# Altium project Asterisk TSOP board.PrjPCB
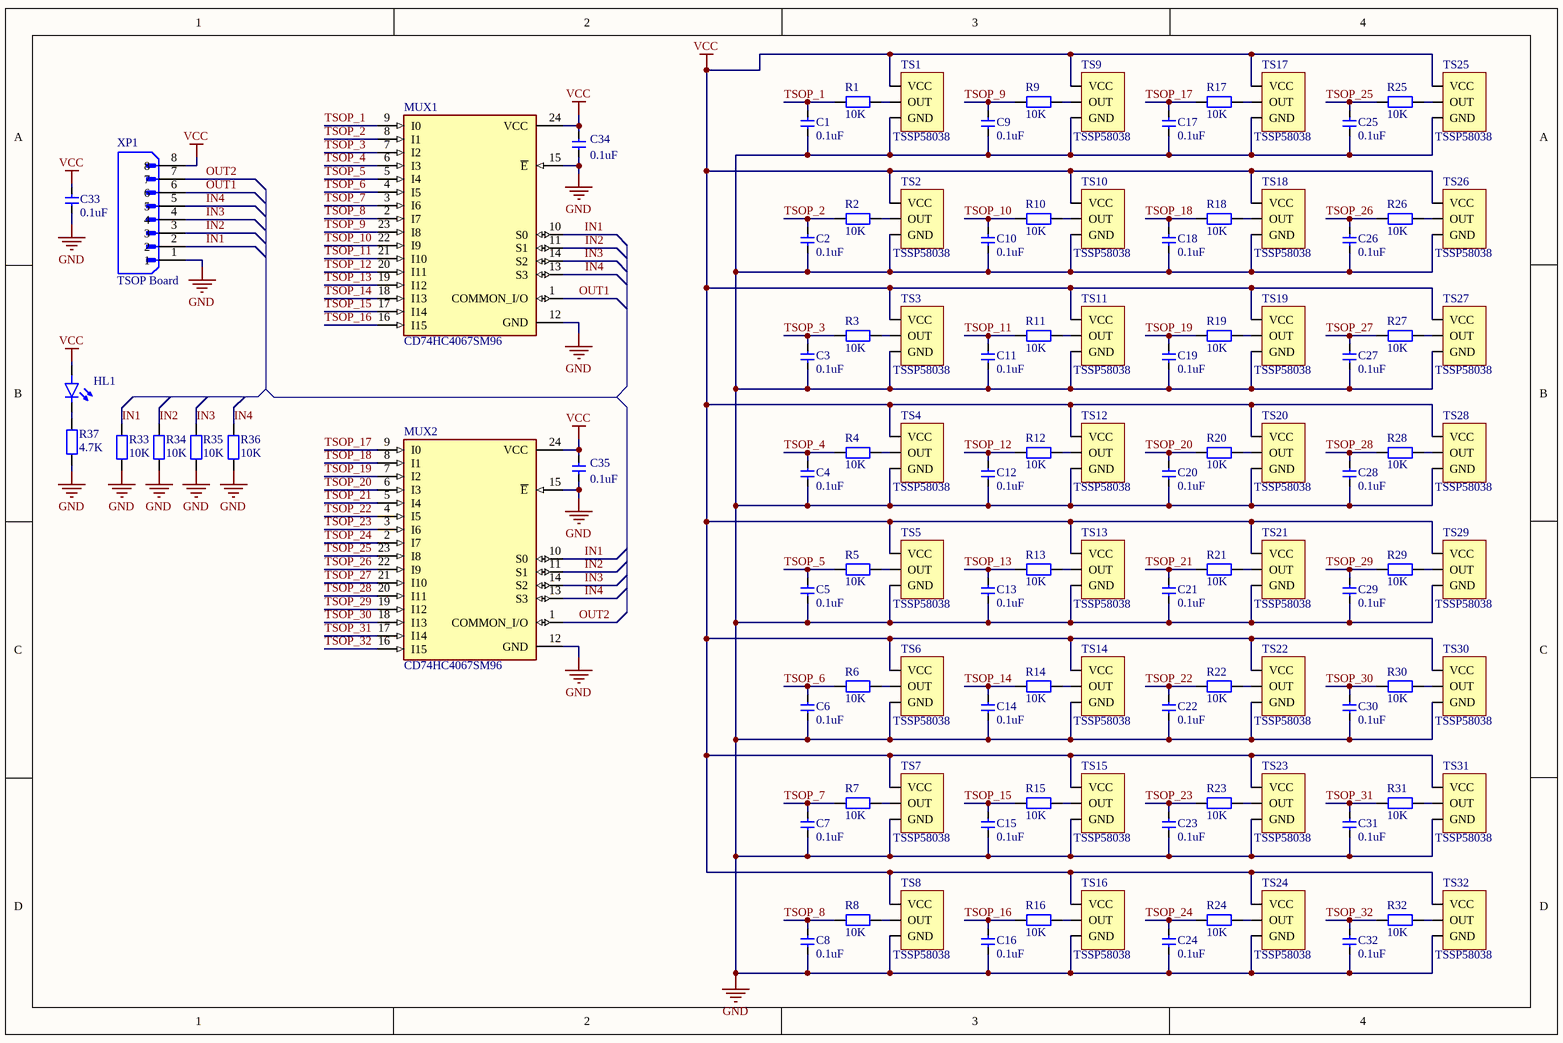
[diagram p0: tsop_board.SchDoc]
1 sheet, 108 parts. Net scope: global (net labels, ports and power ports of the same name join across sheets).
Board file: asterisk_tsop_board.PcbDoc

## Sheet tsop_board.SchDoc
size A4

### Parts
C1  0.1uF  [CAP0805]
C2  0.1uF  [CAP0805]
C3  0.1uF  [CAP0805]
C4  0.1uF  [CAP0805]
C5  0.1uF  [CAP0805]
C6  0.1uF  [CAP0805]
C7  0.1uF  [CAP0805]
C8  0.1uF  [CAP0805]
C9  0.1uF  [CAP0805]
C10  0.1uF  [CAP0805]
C11  0.1uF  [CAP0805]
C12  0.1uF  [CAP0805]
C13  0.1uF  [CAP0805]
C14  0.1uF  [CAP0805]
C15  0.1uF  [CAP0805]
C16  0.1uF  [CAP0805]
C17  0.1uF  [CAP0805]
C18  0.1uF  [CAP0805]
C19  0.1uF  [CAP0805]
C20  0.1uF  [CAP0805]
C21  0.1uF  [CAP0805]
C22  0.1uF  [CAP0805]
C23  0.1uF  [CAP0805]
C24  0.1uF  [CAP0805]
C25  0.1uF  [CAP0805]
C26  0.1uF  [CAP0805]
C27  0.1uF  [CAP0805]
C28  0.1uF  [CAP0805]
C29  0.1uF  [CAP0805]
C30  0.1uF  [CAP0805]
C31  0.1uF  [CAP0805]
C32  0.1uF  [CAP0805]
C33  0.1uF  [CAP0805]
C34  0.1uF  [CAP0805]
C35  0.1uF  [CAP0805]
HL1  VCC  [LED0603_GREEN]  (value not drawn)
MUX1  CD74HC4067SM96  [SSOP-24]
MUX2  CD74HC4067SM96  [SSOP-24]
R1  10K  [RES0805]
R2  10K  [RES0805]
R3  10K  [RES0805]
R4  10K  [RES0805]
R5  10K  [RES0805]
R6  10K  [RES0805]
R7  10K  [RES0805]
R8  10K  [RES0805]
R9  10K  [RES0805]
R10  10K  [RES0805]
R11  10K  [RES0805]
R12  10K  [RES0805]
R13  10K  [RES0805]
R14  10K  [RES0805]
R15  10K  [RES0805]
R16  10K  [RES0805]
R17  10K  [RES0805]
R18  10K  [RES0805]
R19  10K  [RES0805]
R20  10K  [RES0805]
R21  10K  [RES0805]
R22  10K  [RES0805]
R23  10K  [RES0805]
R24  10K  [RES0805]
R25  10K  [RES0805]
R26  10K  [RES0805]
R27  10K  [RES0805]
R28  10K  [RES0805]
R29  10K  [RES0805]
R30  10K  [RES0805]
R31  10K  [RES0805]
R32  10K  [RES0805]
R33  10K  [RES0805]
R34  10K  [RES0805]
R35  10K  [RES0805]
R36  10K  [RES0805]
R37  4.7K  [RES0805]
TS1  TSSP58038  [TSSP58038 (clear)]
TS2  TSSP58038  [TSSP58038 (clear)]
TS3  TSSP58038  [TSSP58038 (clear)]
TS4  TSSP58038  [TSSP58038 (clear)]
TS5  TSSP58038  [TSSP58038 (clear)]
TS6  TSSP58038  [TSSP58038 (clear)]
TS7  TSSP58038  [TSSP58038 (clear)]
TS8  TSSP58038  [TSSP58038 (clear)]
TS9  TSSP58038  [TSSP58038 (clear)]
TS10  TSSP58038  [TSSP58038 (clear)]
TS11  TSSP58038  [TSSP58038 (clear)]
TS12  TSSP58038  [TSSP58038 (clear)]
TS13  TSSP58038  [TSSP58038 (clear)]
TS14  TSSP58038  [TSSP58038 (clear)]
TS15  TSSP58038  [TSSP58038 (clear)]
TS16  TSSP58038  [TSSP58038 (clear)]
TS17  TSSP58038  [TSSP58038 (clear)]
TS18  TSSP58038  [TSSP58038 (clear)]
TS19  TSSP58038  [TSSP58038 (clear)]
TS20  TSSP58038  [TSSP58038 (clear)]
TS21  TSSP58038  [TSSP58038 (clear)]
TS22  TSSP58038  [TSSP58038 (clear)]
TS23  TSSP58038  [TSSP58038 (clear)]
TS24  TSSP58038  [TSSP58038 (clear)]
TS25  TSSP58038  [TSSP58038 (clear)]
TS26  TSSP58038  [TSSP58038 (clear)]
TS27  TSSP58038  [TSSP58038 (clear)]
TS28  TSSP58038  [TSSP58038 (clear)]
TS29  TSSP58038  [TSSP58038 (clear)]
TS30  TSSP58038  [TSSP58038 (clear)]
TS31  TSSP58038  [TSSP58038 (clear)]
TS32  TSSP58038  [TSSP58038 (clear)]
XP1  TSOP Board  [JST_XH-8]

### Nets
GND: C1.1 C2.1 C3.1 C4.1 C5.1 C6.1 C7.1 C8.1 C9.1 C10.1 C11.1 C12.1 C13.1 C14.1 C15.1 C16.1 C17.1 C18.1 C19.1 C20.1 C21.1 C22.1 C23.1 C24.1 C25.1 C26.1 C27.1 C28.1 C29.1 C30.1 C31.1 C32.1 C33.1 C34.1 C35.1 MUX1.12(GND) MUX1.15(~{E}) MUX2.12(GND) MUX2.15(~{E}) R33.1 R34.1 R35.1 R36.1 R37.1 TS1.2(GND) TS2.2(GND) TS3.2(GND) TS4.2(GND) TS5.2(GND) TS6.2(GND) TS7.2(GND) TS8.2(GND) TS9.2(GND) TS10.2(GND) TS11.2(GND) TS12.2(GND) TS13.2(GND) TS14.2(GND) TS15.2(GND) TS16.2(GND) TS17.2(GND) TS18.2(GND) TS19.2(GND) TS20.2(GND) TS21.2(GND) TS22.2(GND) TS23.2(GND) TS24.2(GND) TS25.2(GND) TS26.2(GND) TS27.2(GND) TS28.2(GND) TS29.2(GND) TS30.2(GND) TS31.2(GND) TS32.2(GND) XP1.1
VCC: C33.2 C34.2 C35.2 HL1.2(A) MUX1.24(VCC) MUX2.24(VCC) TS1.1(VCC) TS2.1(VCC) TS3.1(VCC) TS4.1(VCC) TS5.1(VCC) TS6.1(VCC) TS7.1(VCC) TS8.1(VCC) TS9.1(VCC) TS10.1(VCC) TS11.1(VCC) TS12.1(VCC) TS13.1(VCC) TS14.1(VCC) TS15.1(VCC) TS16.1(VCC) TS17.1(VCC) TS18.1(VCC) TS19.1(VCC) TS20.1(VCC) TS21.1(VCC) TS22.1(VCC) TS23.1(VCC) TS24.1(VCC) TS25.1(VCC) TS26.1(VCC) TS27.1(VCC) TS28.1(VCC) TS29.1(VCC) TS30.1(VCC) TS31.1(VCC) TS32.1(VCC) XP1.8
IN1: MUX1.10(S0) MUX2.10(S0) R33.2 XP1.2
IN2: MUX1.11(S1) MUX2.11(S1) R34.2 XP1.3
IN3: MUX1.14(S2) MUX2.14(S2) R35.2 XP1.4
IN4: MUX1.13(S3) MUX2.13(S3) R36.2 XP1.5
OUT1: MUX1.1(COMMON_I/O) XP1.6
OUT2: MUX2.1(COMMON_I/O) XP1.7
TSOP_1: C1.2 MUX1.9(I0) R1.1
TSOP_2: C2.2 MUX1.8(I1) R2.1
TSOP_3: C3.2 MUX1.7(I2) R3.1
TSOP_4: C4.2 MUX1.6(I3) R4.1
TSOP_5: C5.2 MUX1.5(I4) R5.1
TSOP_6: C6.2 MUX1.4(I5) R6.1
TSOP_7: C7.2 MUX1.3(I6) R7.1
TSOP_8: C8.2 MUX1.2(I7) R8.1
TSOP_9: C9.2 MUX1.23(I8) R9.1
TSOP_10: C10.2 MUX1.22(I9) R10.1
TSOP_11: C11.2 MUX1.21(I10) R11.1
TSOP_12: C12.2 MUX1.20(I11) R12.1
TSOP_13: C13.2 MUX1.19(I12) R13.1
TSOP_14: C14.2 MUX1.18(I13) R14.1
TSOP_15: C15.2 MUX1.17(I14) R15.1
TSOP_16: C16.2 MUX1.16(I15) R16.1
TSOP_17: C17.2 MUX2.9(I0) R17.1
TSOP_18: C18.2 MUX2.8(I1) R18.1
TSOP_19: C19.2 MUX2.7(I2) R19.1
TSOP_20: C20.2 MUX2.6(I3) R20.1
TSOP_21: C21.2 MUX2.5(I4) R21.1
TSOP_22: C22.2 MUX2.4(I5) R22.1
TSOP_23: C23.2 MUX2.3(I6) R23.1
TSOP_24: C24.2 MUX2.2(I7) R24.1
TSOP_25: C25.2 MUX2.23(I8) R25.1
TSOP_26: C26.2 MUX2.22(I9) R26.1
TSOP_27: C27.2 MUX2.21(I10) R27.1
TSOP_28: C28.2 MUX2.20(I11) R28.1
TSOP_29: C29.2 MUX2.19(I12) R29.1
TSOP_30: C30.2 MUX2.18(I13) R30.1
TSOP_31: C31.2 MUX2.17(I14) R31.1
TSOP_32: C32.2 MUX2.16(I15) R32.1
NetHL1_1: HL1.1(K) R37.2
NetR1_2: R1.2 TS1.3(OUT)
NetR2_2: R2.2 TS2.3(OUT)
NetR3_2: R3.2 TS3.3(OUT)
NetR4_2: R4.2 TS4.3(OUT)
NetR5_2: R5.2 TS5.3(OUT)
NetR6_2: R6.2 TS6.3(OUT)
NetR7_2: R7.2 TS7.3(OUT)
NetR8_2: R8.2 TS8.3(OUT)
NetR9_2: R9.2 TS9.3(OUT)
NetR10_2: R10.2 TS10.3(OUT)
NetR11_2: R11.2 TS11.3(OUT)
NetR12_2: R12.2 TS12.3(OUT)
NetR13_2: R13.2 TS13.3(OUT)
NetR14_2: R14.2 TS14.3(OUT)
NetR15_2: R15.2 TS15.3(OUT)
NetR16_2: R16.2 TS16.3(OUT)
NetR17_2: R17.2 TS17.3(OUT)
NetR18_2: R18.2 TS18.3(OUT)
NetR19_2: R19.2 TS19.3(OUT)
NetR20_2: R20.2 TS20.3(OUT)
NetR21_2: R21.2 TS21.3(OUT)
NetR22_2: R22.2 TS22.3(OUT)
NetR23_2: R23.2 TS23.3(OUT)
NetR24_2: R24.2 TS24.3(OUT)
NetR25_2: R25.2 TS25.3(OUT)
NetR26_2: R26.2 TS26.3(OUT)
NetR27_2: R27.2 TS27.3(OUT)
NetR28_2: R28.2 TS28.3(OUT)
NetR29_2: R29.2 TS29.3(OUT)
NetR30_2: R30.2 TS30.3(OUT)
NetR31_2: R31.2 TS31.3(OUT)
NetR32_2: R32.2 TS32.3(OUT)

### Library data of the parts
C1-C35 = CAP Ceramic: Ceramic SMD Cap
HL1 = LED: LED smd
MUX1 MUX2 = CD74HC4067SM96: 16-channel multiplexer; ComponentLink1Description: Chipdip; ComponentLink1URL: https://www.chipdip.ru/product0/8016170563
R1-R37 = RES: RES smd
TS1-TS32 = TSSP58038: TSOP TSSP58038
XP1 = JST-XH-8: JST_B8B-XH-A(LF)(SN)